# EAGLE design WisBlock-IO-SDI12 (EAGLE 9.6.2)

## Sheet 1 of 2
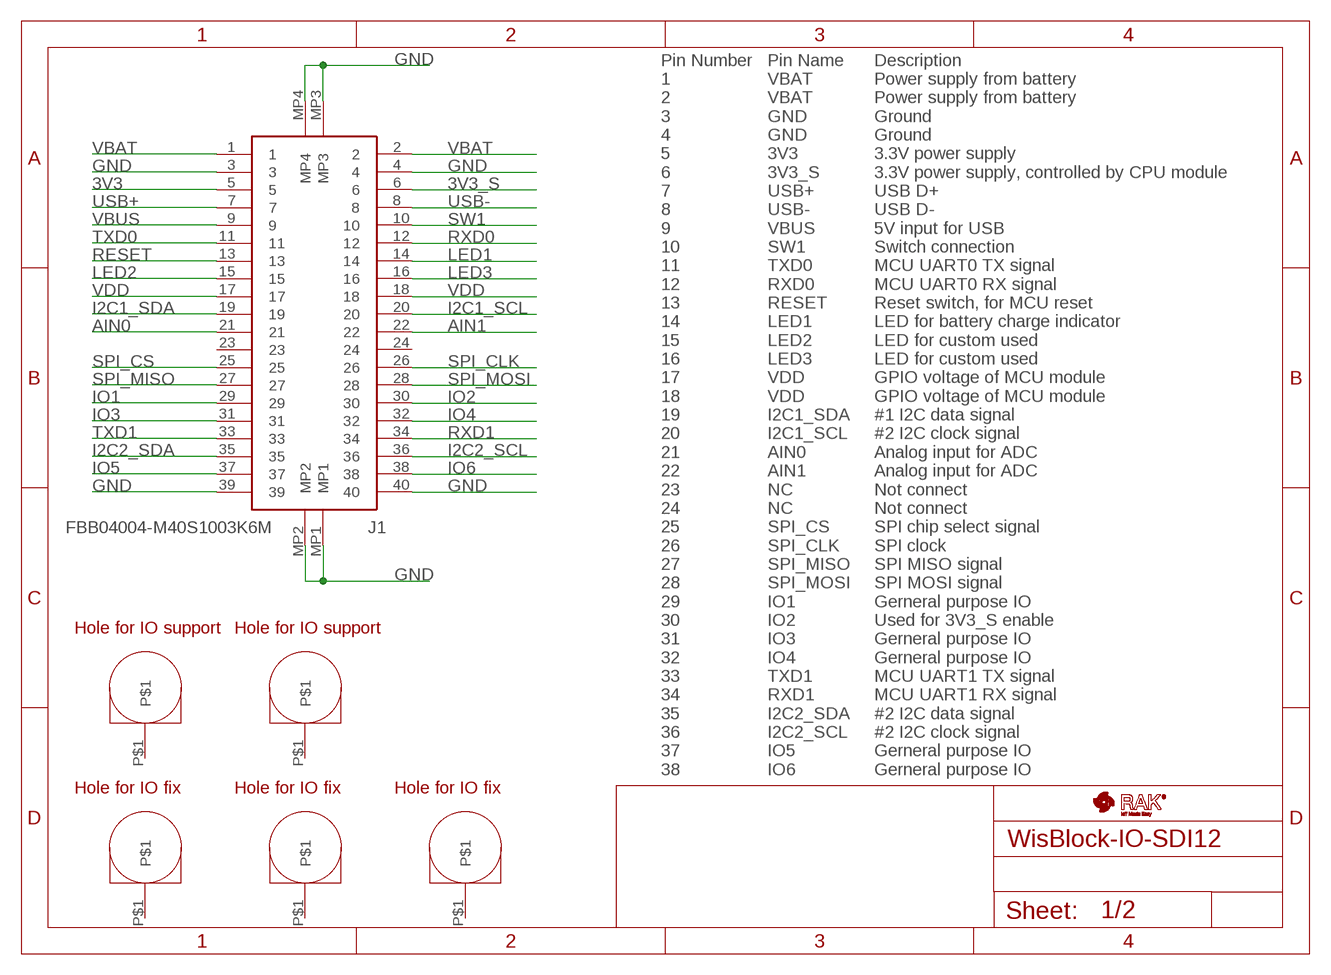
[diagram p0: schematic, sheet 1]

### Parts
J1  FBB04004-M40S1003K6M  [FBB04004M40S1003K6M]
U$1  RAK_LOGO  [WISBLOCK_LOGO]
U$2  RAK_IO_FIX_LARGE  [RAK_IO_FIX_LARGE]
U$3  RAK_IO_FIX_LARGE  [RAK_IO_FIX_LARGE]
U$4  RAK_IO_FIX_SMALL  [RAK_IO_FIX_SMALL]
U$5  RAK_IO_FIX_SMALL  [RAK_IO_FIX_SMALL]
U$6  RAK_IO_FIX_SMALL  [RAK_IO_FIX_SMALL]

### Nets
3V3: J1.5
3V3_S: J1.6 ; also sheet 2
AIN0: J1.21
AIN1: J1.22
GND: J1.3 J1.4 J1.39 J1.40 J1.MP1 J1.MP2 J1.MP3 J1.MP4 ; also sheet 2
I2C1_SCL: J1.20 ; also sheet 2
I2C1_SDA: J1.19 ; also sheet 2
I2C2_SCL: J1.36
I2C2_SDA: J1.35
IO1: J1.29
IO2: J1.30
IO3: J1.31 ; also sheet 2
IO4: J1.32 ; also sheet 2
IO5: J1.37 ; also sheet 2
IO6: J1.38 ; also sheet 2
LED1: J1.14
LED2: J1.15
LED3: J1.16
RESET: J1.13
RXD0: J1.12
RXD1: J1.34 ; also sheet 2
SPI_CLK: J1.26
SPI_CS: J1.25
SPI_MISO: J1.27
SPI_MOSI: J1.28
SW1: J1.10
TXD0: J1.11
TXD1: J1.33 ; also sheet 2
USB+: J1.7
USB-: J1.8
VBAT: J1.1 J1.2 ; also sheet 2
VBUS: J1.9
VDD: J1.17 J1.18
Unconnected: J1.23 J1.24 U$2.P$1 U$3.P$1 U$4.P$1 U$5.P$1 U$6.P$1

### Notes on the sheet
- Pin Number 
  1 
  2 
  3 
  4 
  5 
  6 
  7 
  8 
  9 
  10 
  11 
  12 
  13 
  14 
  15 
  16 
  17 
  18 
  19 
  20 
  21 
  22 
  23 
  24 
  25 
  26 
  27 
  28 
  29 
  30 
  31 
  32 
  33 
  34 
  35 
  36 
  37 
  38
- Pin Name 
  VBAT 
  VBAT 
  GND 
  GND 
  3V3 
  3V3_S 
  USB+ 
  USB- 
  VBUS 
  SW1 
  TXD0 
  RXD0 
  RESET 
  LED1 
  LED2 
  LED3 
  VDD 
  VDD 
  I2C1_SDA 
  I2C1_SCL 
  AIN0 
  AIN1 
  NC 
  NC 
  SPI_CS 
  SPI_CLK 
  SPI_MISO 
  SPI_MOSI 
  IO1 
  IO2 
  IO3 
  IO4 
  TXD1 
  RXD1 
  I2C2_SDA 
  I2C2_SCL 
  IO5 
  IO6
- Description 
  Power supply from battery 
  Power supply from battery 
  Ground 
  Ground 
  3.3V power supply 
  3.3V power supply, controlled by CPU module 
  USB D+ 
  USB D- 
  5V input for USB 
  Switch connection 
  MCU UART0 TX signal 
  MCU UART0 RX signal 
  Reset switch, for MCU reset 
  LED for battery charge indicator 
  LED for custom used 
  LED for custom used 
  GPIO voltage of MCU module 
  GPIO voltage of MCU module 
  #1 I2C data signal 
  #2 I2C clock signal 
  Analog input for ADC 
  Analog input for ADC 
  Not connect 
  Not connect 
  SPI chip select signal 
  SPI clock 
  SPI MISO signal 
  SPI MOSI signal 
  Gerneral purpose IO 
  Used for 3V3_S enable 
  Gerneral purpose IO 
  Gerneral purpose IO 
  MCU UART1 TX signal 
  MCU UART1 RX signal 
  #2 I2C data signal 
  #2 I2C clock signal 
  Gerneral purpose IO 
  Gerneral purpose IO

## Sheet 2 of 2
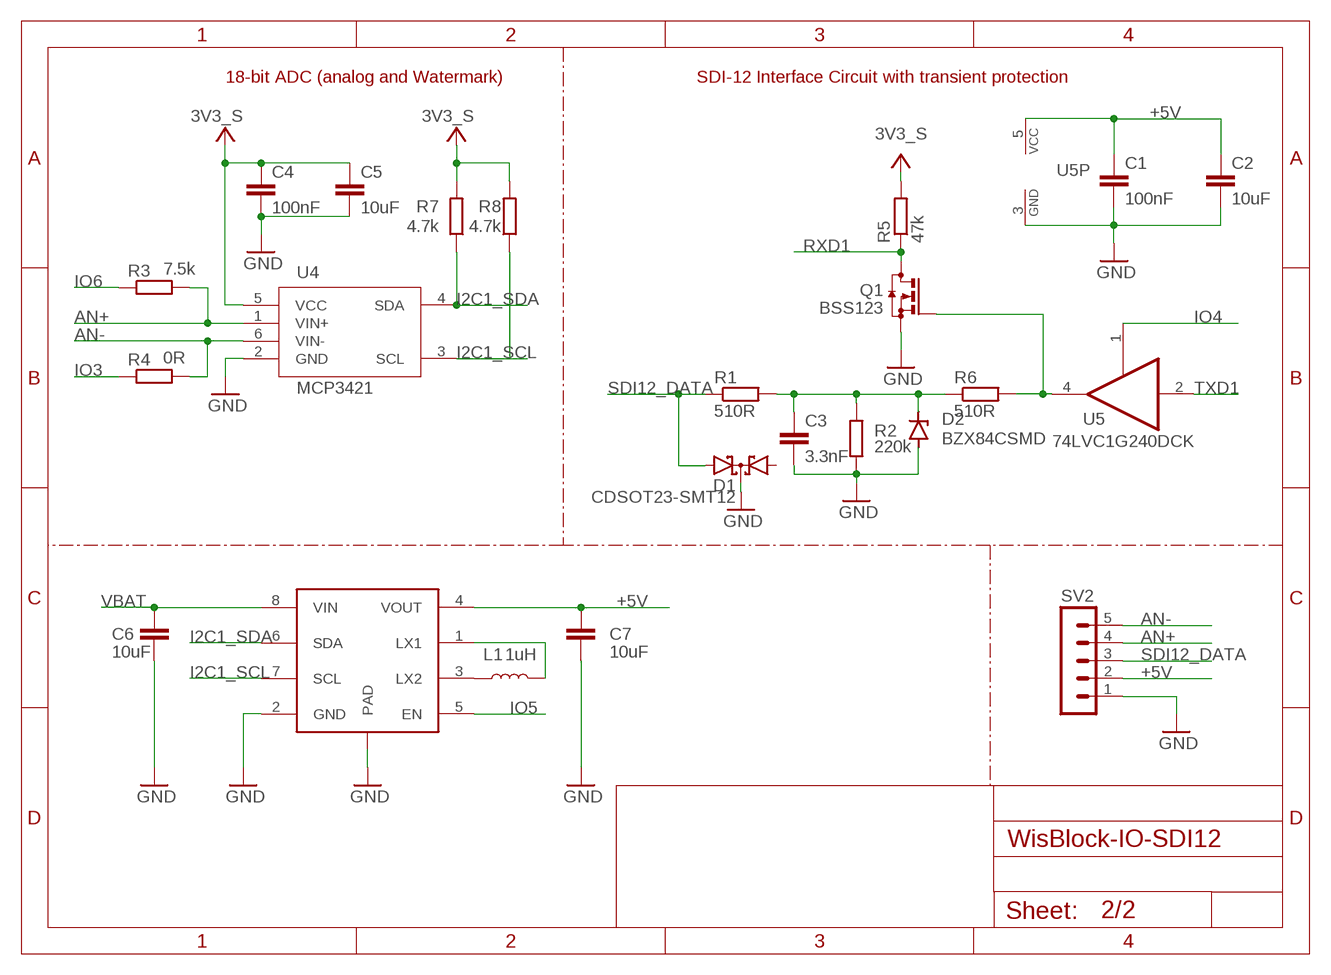
[diagram p1: schematic, sheet 2]

### Parts
C1  100nF  SCHMALZHAUS_CAP0603-CAP  [SCHMALZHAUS_0603-CAP]
C2  10uF  SCHMALZHAUS_CAP0603-CAP  [SCHMALZHAUS_0603-CAP]
C3  3.3nF  C-EUC0603K  [C0603K]
C4  100nF  SCHMALZHAUS_CAP0603-CAP  [SCHMALZHAUS_0603-CAP]
C5  10uF  SCHMALZHAUS_CAP0603-CAP  [SCHMALZHAUS_0603-CAP]
C6  10uF  SCHMALZHAUS_CAP0603-CAP  [SCHMALZHAUS_0603-CAP]
C7  10uF  SCHMALZHAUS_CAP0603-CAP  [SCHMALZHAUS_0603-CAP]
D1  CDSOT23-SMT12  BAS40-05  [SOT23]
D2  BZX84CSMD  [TO236]
L1  1uH  INDUCTOR-0603-33NH  [0603]
Q1  BSS123  [SOT23]
R1  510R  R-EU_R0603  [R0603]
R2  220k  R-EU_R0603  [R0603]
R3  7.5k  R-EU_R0603  [R0603]
R4  0R  R-EU_R0603  [R0603]
R5  47k  R-EU_R0603  [R0603]
R6  510R  R-EU_R0603  [R0603]
R7  4.7k  R-EU_R0603  [R0603]
R8  4.7k  R-EU_R0603  [R0603]
SV2  MA05-1  [MA05-1]
U1  ISL9122A  [8-DFN]
U4  MCP3421  [SOT23-6]
U5  74LVC1G240DCK  74AHC1G126DBV  [SOT23-5]

### Nets
3V3_S: C4.1 C5.1 R5.2 R7.2 R8.2 U4.5(VCC) ; also sheet 1
+5V: C1.1 C2.1 C7.1 SV2.2 U1.4(VOUT) U5.5(VCC)
AN+: R3.2 SV2.4 U4.1(VIN+)
AN-: R4.2 SV2.5 U4.6(VIN-)
GND: C1.2 C2.2 C3.2 C4.2 C5.2 C6.2 C7.2 D1.3(C) D2.A Q1.2(S) R2.1 SV2.1 U1.2(GND) U1.PAD U4.2(GND) U5.3(GND) ; also sheet 1
I2C1_SCL: R8.1 U1.7(SCL) U4.3(SCL) ; also sheet 1
I2C1_SDA: R7.1 U1.6(SDA) U4.4(SDA) ; also sheet 1
IO3: R4.1 ; also sheet 1
IO4: U5.1(OE) ; also sheet 1
IO5: U1.5(EN) ; also sheet 1
IO6: R3.1 ; also sheet 1
N$2: C3.1 D2.C R1.2 R2.2 R6.1
N$3: L1.1 U1.3(LX2)
N$4: L1.2 U1.1(LX1)
N$12: Q1.1(G) R6.2 U5.4(O)
RXD1: Q1.3(D) R5.1 ; also sheet 1
SDI12_DATA: D1.2(A2) R1.1 SV2.3
TXD1: U5.2(I) ; also sheet 1
VBAT: C6.1 U1.8(VIN) ; also sheet 1
Unconnected: D1.1(A1)

### Notes on the sheet
- 18-bit ADC (analog and Watermark) | SDI-12 Interface Circuit with transient protection

## Library data of the parts
C1 C4 = FubarinoMini_v16:SCHMALZHAUS_CAP: Capacitor Standard 0603 ceramic capacitor, and 0.1" leaded capacitor.; MF: AVX; MPN: 06033C104KAT4A; OC_DIGIKEY: 399-5089-1-ND; OC_FARNELL: 2332586
C2 C5-C7 = FubarinoMini_v16:SCHMALZHAUS_CAP: Capacitor Standard 0603 ceramic capacitor, and 0.1" leaded capacitor.; MF: AVX; MPN: 0805ZC106KAT2A; OC_DIGIKEY: 1276-1096-1-ND; OC_FARNELL: 2094042
C3 = rcl:C-EU: CAPACITOR, European symbol; SPICEPREFIX: C
D1 = diode:BAS40-05: Silicon Schottky Diodes General-purpose diode for high-speed switching; RS: 767-3728
D2 = diode:BZX84CSMD: Z DIODE
J1 = FBB04004-M40S1003K6M:FBB04004-M40S1003K6M: Mezzanine Connectors (Board to Board) SMD RoHS 40 Pos Source: Datasheet <https://tupian.txga.com/serials-attach/FBB04004-M/Drawing-FBB04004-M.pdf>; ARROW_PART_NUMBER: FBB04004-M40S1003K6M; DESCRIPTION: Mezzanine Connectors (Board to Board) SMD RoHS 40 Pos; HEIGHT: 0.95mm; MANUFACTURER_NAME: TXGA; MANUFACTURER_PART_NUMBER: FBB04004-M40S1003K6M
L1 = SparkFun-Coils:INDUCTOR: Inductors Resist changes in electrical current. Basically a coil of wire. SparkFun Products: SparkFun Load Cell Amplifier - HX711 <https://www.sparkfun.com/products/13879> IOIO-OTG - V2.2 <https://www.sparkfun.com/products/13613>; PROD_ID: NDUC-07874; VALUE: 33nH/±5%/500mA
Q1 = transistor-small-signal:BSS123: N-CHANNEL MOS FET
R1-R8 = resistor:R-EU_: RESISTOR, European symbol
SV2 = con-lstb:MA05-1: PIN HEADER; OC_FARNELL: unknown; OC_NEWARK: unknown
U1 = MyLabrary_Valente:ISL9122A
U4 = MFHPP_v2.0:MCP3421; MF: MICROCHIP; MPN: MCP3421A0T-E/CH; OC_FARNELL: 1605567
U5 = 74xx-little-us:74*1G126: Single Bus Buffer Gate With 3-State Outputs
U$1 = WisBlock-Template:RAK_LOGO
U$2 U$3 = WisBlock:RAK_IO_FIX_LARGE
U$4-U$6 = WisBlock:RAK_IO_FIX_SMALL

## Board
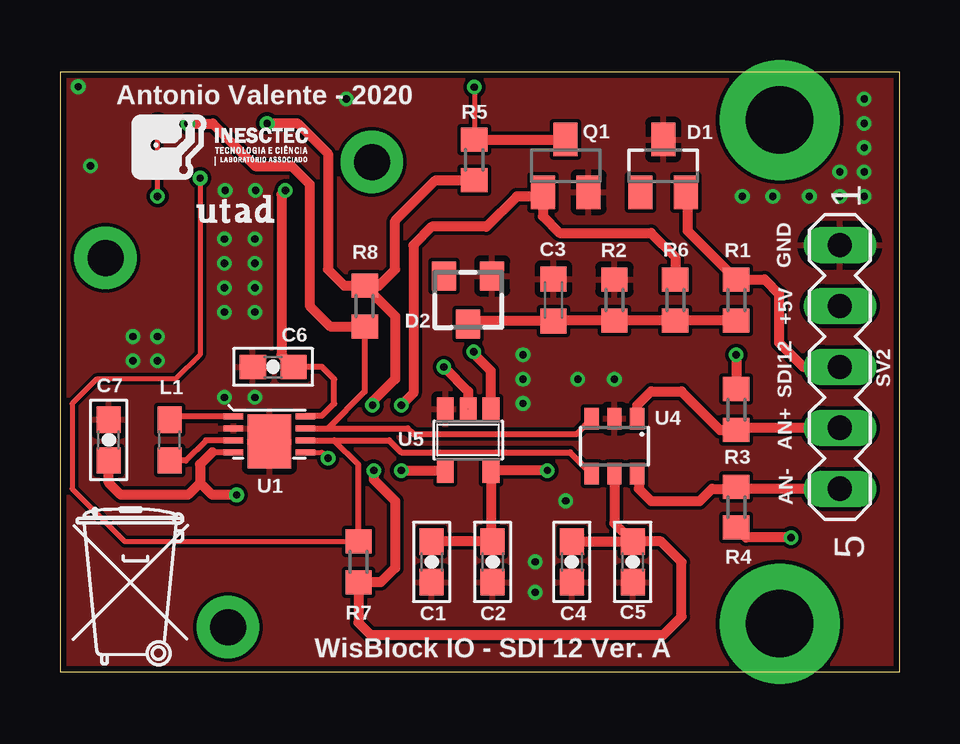
[diagram p2: board, top side]
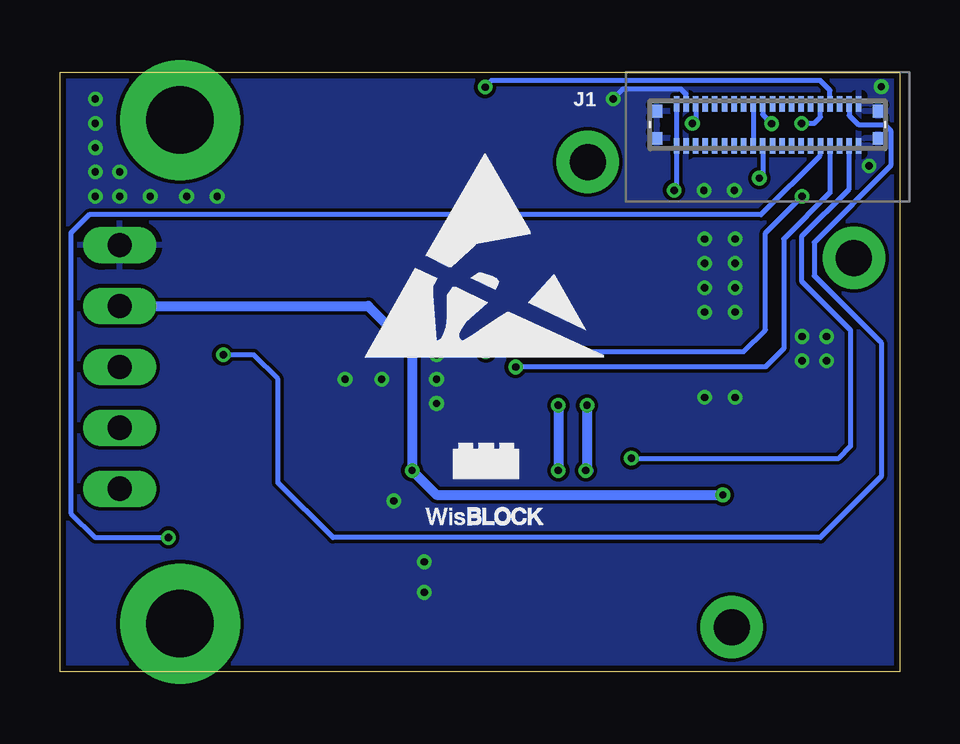
[diagram p3: board, bottom side, seen from below]

Size 35 x 25 mm. Coordinates in mm from the lower left corner, seen from the top.
Outline: 0,0 35,0 35,25 0,25 0,0
Copper layers (1*16): Top 0.035mm / dielectric 1.5mm / Bottom 0.035mm
Design rules "SeeedStudio_2layer_DRU_no_angle_20140221": minimum track width 6mil, minimum drill 12mil, track to track 6mil, track to pad 6mil, pad to pad 6mil, via to via 6mil, smd to smd 0mil, copper to edge 10mil, drill to drill 10mil, minimum pad ring 10mil, minimum via ring 6mil, stop-mask expansion 2mil, vias tented up to drill 100mil, thermal gap 10mil

### Footprints (pad centres in the part's own frame; a part is rotated, then mirrored left to right if it is on the bottom)
SCHMALZHAUS_0603-CAP = smd 1.1 x 1: 1 -0.85,0; 2 0.85,0
C0603K = smd 1.05 x 1.08: 1 -0.875,0; 2 0.875,0
SOT23 = smd 1 x 1.4: 1 -0.95,-1.1; 2 0.95,-1.1; 3 0,1.1
TO236 = smd 1 x 1.2: A -1,-1; C 0,1; NC 1,-1
FBB04004M40S1003K6M = smd 0.23 x 0.65: 1 -3.8,-0.875; 2 -3.8,0.875; 3 -3.4,-0.875; 4 -3.4,0.875; 5 -3,-0.875; 6 -3,0.875; 7 -2.6,-0.875; 8 -2.6,0.875; 9 -2.2,-0.875; 10 -2.2,0.875; 11 -1.8,-0.875; 12 -1.8,0.875; 13 -1.4,-0.875; 14 -1.4,0.875; 15 -1,-0.875; 16 -1,0.875; 17 -0.6,-0.875; 18 -0.6,0.875; 19 -0.2,-0.875; 20 -0.2,0.875; 21 0.2,-0.875; 22 0.2,0.875; 23 0.6,-0.875; 24 0.6,0.875; 25 1,-0.875; 26 1,0.875; 27 1.4,-0.875; 28 1.4,0.875; 29 1.8,-0.875; 30 1.8,0.875; 31 2.2,-0.875; 32 2.2,0.875; 33 2.6,-0.875; 34 2.6,0.875; 35 3,-0.875; 36 3,0.875; 37 3.4,-0.875; 38 3.4,0.875; 39 3.8,-0.875; 40 3.8,0.875 | smd 0.45 x 0.53: MP1 4.605,0.565; MP2 4.605,-0.565; MP3 -4.605,0.565; MP4 -4.605,-0.565
0603 = smd 1.1 x 1: 1 -0.85,0; 2 0.85,0
R0603 = smd 1 x 1.1: 1 -0.85,0; 2 0.85,0
MA05-1 = drill 1.016 long: 1 -5.08,0; 2 -2.54,0; 3 0,0; 4 2.54,0; 5 5.08,0
8-DFN = smd 0.25 x 0.8: 1 -0.75,-1.5; 2 -0.25,-1.5; 3 0.25,-1.5; 4 0.75,-1.5; 5 0.75,1.5; 6 0.25,1.5; 7 -0.25,1.5; 8 -0.75,1.5 | smd 2.25 x 1.8: PAD 0.3,0
SOT23-6 = smd 0.6 x 0.9: 1 -0.95,-1.15; 2 0,-1.15; 3 0.95,-1.15; 4 0.95,1.15; 5 0,1.15; 6 -0.95,1.15
SOT23-5 = smd 0.69 x 0.99: 1 -0.95,-1.29; 2 0,-1.29; 3 0.95,-1.29; 4 0.95,1.3; 5 -0.95,1.3
RAK_IO_FIX_LARGE = drill 2.8 pad 5: P$1 0,0
RAK_IO_FIX_SMALL = drill 1.5 pad 2.6: P$1 0,0

### Placement (x,y rotation side)
C1  15.49,4.57 270 top
C2  18.03,4.57 270 top
C3  20.57,15.49 90 top
C4  21.34,4.57 270 top
C5  23.88,4.57 270 top
C6  8.89,12.7 180 top
C7  2.03,9.65 90 top
D1  25.15,21.08 0 top
D2  17.02,15.49 180 top
J1  5.5,22.8 0 bottom
L1  4.57,9.65 90 top
Q1  21.08,21.08 0 top
R1  28.19,15.49 270 top
R2  23.11,15.49 270 top
R3  28.19,10.92 270 top
R4  28.19,6.86 90 top
R5  17.27,21.34 270 top
R6  25.65,15.49 90 top
R7  12.45,4.57 270 top
R8  12.7,15.24 90 top
SV2  32.51,12.7 270 top
U1  8.73,9.89 270 top
U4  23.11,9.4 180 top
U5  17.02,9.65 180 top
U$1  14.66,5.97 0 top
U$2  30,23 0 top
U$3  30,2 0 top
U$4  7,1.85 0 top
U$5  1.9,17.25 0 top
U$6  13,21.25 0 top
U$7  [INESCTEC_5MM]  2.98,20.52 0 top
U$8  [UTAD_NEW_5MM]  5.7,18.64 0 top
U$9  [TONNE_10.00]  2.82,1.73 0 top
U$10  [ESD_10.00]  22.38,13.01 0 bottom

### Tracks (layer width: path | path; a pad name or v marks a point on that pad's centre or on a via)
3V3_S  (via drill 0.3)
  Top 0.406: C5.1 23.11,6.18 U4.5 | C4.1 C5.1 | v8.64,22.86 9.91,22.86 11.18,21.59 11.18,16.76 11.85,16.09 R8.2 | R8.2 13.3,16.09 13.97,16.76 13.97,18.8 15.66,20.49 R5.2 | C5.1 25.06,5.42 25.91,4.57 25.91,2.29 25.15,1.52 12.95,1.52 12.45,2.03 R7.2 13.37,3.72 13.97,4.32 13.97,7.11 13.08,8 v13.08,8.38 | R8.2 13.97,14.82 13.97,12.19 12.95,11.18 v13.03,11.1
  Bottom 0.203: J1.6 8.5,23 v8.64,22.86
  Bottom 0.406: v13.03,11.1 13.03,8.46 12.95,8.38 v13.08,8.38
+5V  (via drill 0.3)
  Top 0.254: U1.4 6.35,9.14
  Top 0.406: C1.1 C2.1 17.97,5.49 U5.5 18,8.38 v20.32,8.38 | 6.35,9.14 5.84,8.64 5.84,7.87 | 5.84,7.87 5.33,7.37 2.54,7.37 2.03,7.87 C7.1 | v7.37,7.37 6.35,7.37 5.84,7.87
  Bottom 0.406: SV2.2 22.15,15.24 20.32,13.41 v20.32,8.38 19.3,7.37 v7.37,7.37
AN+
  Top 0.406: SV2.4 28.28,10.16 R3.2 27.52,10.07 25.91,11.68 24.64,11.68 24.06,11.11 U4.1
AN-
  Top 0.406: SV2.5 28.28,7.62 | 28.28,7.62 R4.2 | U4.6 24.13,8.18 24.13,7.62 24.64,7.11 26.67,7.11 27.18,7.62 28.28,7.62
GND  (via drill 0.3)
  Bottom 0.203: J1.4 8.9,24.07 9.11,24.28 11.53,24.28 v11.94,23.88
  other vias: 0.76,24.38 1.27,21.08 3.05,13.97 4.06,13.97 3.05,12.95 4.06,12.95 6.86,11.43 8.13,11.43 6.86,14.99 8.13,14.99 6.86,16 8.13,16 6.86,17.02 8.13,17.02 6.86,18.03 8.13,18.03 6.88,20.07 8.15,20.07 28.45,19.81 29.72,19.81 31.24,19.81 32.51,19.81 32.51,20.83 33.53,19.81 33.53,20.83 33.53,21.84 33.53,22.86 33.53,23.88 19.3,13.21 19.3,12.19 19.3,11.18 21.59,12.19 23.11,12.19 21.08,7.11 19.81,4.57 19.81,3.3
  pour Top: 0,24.89 35.05,24.89 35.05,0 0,0
  pour Bottom: 0,24.89 35.05,24.89 35.05,0 0,0
I2C1_SCL  (via drill 0.3)
  Top 0.254: U4.3 21.52,9.91 14.73,9.91 14.49,10.14 11.18,10.14 | U1.7 11.18,10.14 | R8.1 12.7,11.67 11.18,10.14
  Top 0.406: v5.33,22.84 6.37,22.84 8.13,21.08 9.65,21.08 10.41,20.32 10.41,15.24 11.26,14.39 R8.1
  Bottom 0.203: J1.20 5.7,23.23 v5.33,22.86 v5.33,22.84
I2C1_SDA  (via drill 0.3)
  Top 0.203: v5.84,20.57 5.84,13.21 4.83,12.19 1.52,12.19 0.51,11.18 0.51,7.62 2.71,5.42 R7.1
  Top 0.254: U1.6 11.43,9.64 | 11.43,9.64 13.72,9.64 14.22,9.14 21.27,9.14 U4.4 | R7.1 12.45,8.63 11.43,9.64
  Bottom 0.203: J1.19 5.7,20.72 v5.84,20.57
IO3  (via drill 0.3)
  Top 0.406: v30.48,5.59 28.61,5.59 R4.1
  Bottom 0.203: J1.31 3.33,21.89 3.33,21.5 5.78,19.05 33.78,19.05 34.54,18.29 34.54,6.6 33.53,5.59 v30.48,5.59
IO4  (via drill 0.3)
  Top 0.203: v4.06,19.81 4.06,22.84 v4.08,22.86
  Top 0.406: U5.1 17.97,12.54 17.25,13.26 v17.25,13.34
  Bottom 0.203: v17.25,13.34 6.5,13.34 5.59,14.25 5.59,18.29 v4.06,19.81 | v4.08,22.86 3.56,22.86 3.3,23.12 J1.32
IO5  (via drill 0.3)
  Top 0.203: U1.5 10.92,9.14 v11.18,8.89
  Bottom 0.203: v11.18,8.89 2.54,8.89 2.03,9.4 2.03,14.22 4.06,16.26 4.06,18.16 2.1,20.12 J1.37
IO6  (via drill 0.3)
  Top 0.406: v28.19,13.21 R3.1
  Bottom 0.203: J1.38 2.1,23.18 1.72,22.8 0.62,22.8 0.36,22.55 0.36,21.08 3.56,17.89 3.56,16.51 0.76,13.72 0.76,8.13 3.3,5.59 23.62,5.59 25.91,7.87 25.91,12.19 26.92,13.21 v28.19,13.21
N$2
  Top 0.406: R1.2 R6.1 R2.2 20.6,14.64 C3.1 17.14,14.62 D2.C
N$3
  Top 0.254: U1.3 6.09,9.64 5.25,8.8 L1.1
N$4
  Top 0.254: U1.1 4.71,10.64 L1.2
N$12  (via drill 0.3)
  Top 0.406: R6.2 25.65,17.27 24.64,18.29 20.83,18.29 20.13,18.98 Q1.1 19.96,19.81 19.05,19.81 17.78,18.54 15.49,18.54 14.73,17.78 14.73,11.61 v14.22,11.1 | v14.22,8.38 16.04,8.38 U5.4
  Bottom 0.406: v14.22,11.1 v14.22,8.38
RXD1  (via drill 0.3)
  Top 0.203: v17.27,24.37 R5.1
  Top 0.406: R5.1 Q1.3
  Bottom 0.203: J1.34 2.9,24.24 3.3,24.64 17.02,24.64 17.27,24.38 v17.27,24.37
SDI12_DATA
  Top 0.406: SV2.3 30.99,12.7 29.97,13.72 29.97,15.75 29.38,16.34 R1.1 26.16,18.38 26.16,19.92 D1.2
TXD1  (via drill 0.3)
  Top 0.406: v16,12.7 17.02,11.68 U5.2
  Bottom 0.203: J1.33 2.9,19.96 4.83,18.03 4.83,13.46 5.59,12.7 v16,12.7
VBAT  (via drill 0.3)
  Top 0.254: U1.8 10.26,10.67 10.92,10.67 11.43,11.18 11.43,12.19 10.92,12.7 C6.1
  Top 0.406: C6.1 9.23,13.21 9.23,19.9 v9.4,20.07
  Bottom 0.203: J1.2 J1.1 9.3,20.16 v9.4,20.07
VDD
  Bottom 0.203: J1.18 J1.17

### Text on the board
tPlace: Antonio Valente - 2020 | U1 | WisBlock IO - SDI 12 Ver. A
tNames: GND | +5V | SDI12 | AN+ | AN-